# EAGLE design RS485_junction (EAGLE 9.6.2)
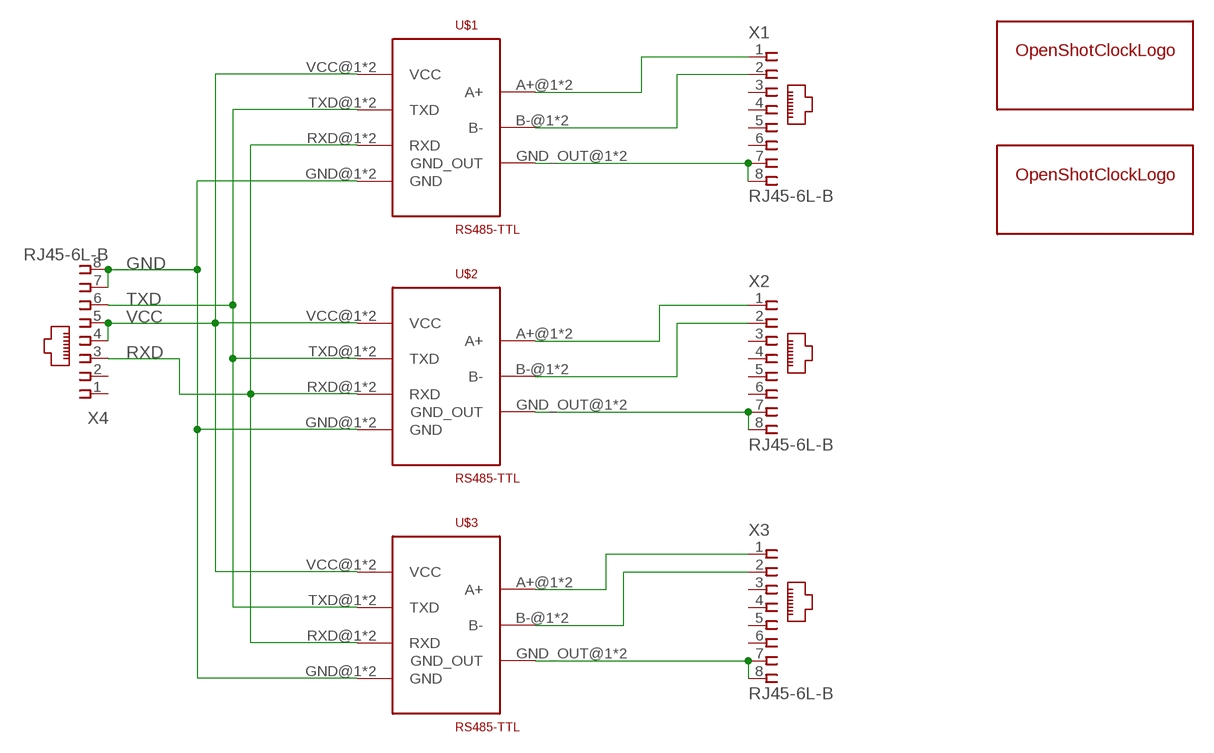
[diagram p0: schematic, sheet 1]

## Parts
U$1  RS485-TTL  [RS485-TTL]
U$2  RS485-TTL  [RS485-TTL]
U$3  RS485-TTL  [RS485-TTL]
U$4  OPEN-SHOT-CLOCK-LOGOOSCL-SMALL  [OPEN-SHOT-CLOCK-LOGO-SMALL]
U$5  OPEN-SHOT-CLOCK-LOGOOSCL-H50MM  [OPEN-SHOT-CLOCK-LOGO-H50MM]
X1  RJ45-6L-B  [RJ45-NO-SHIELD]
X2  RJ45-6L-B  [RJ45-NO-SHIELD]
X3  RJ45-6L-B  [RJ45-NO-SHIELD]
X4  RJ45-6L-B  [RJ45-NO-SHIELD]

## Nets
GND: U$1.GND@1(GND) U$1.GND@2(GND) U$2.GND@1(GND) U$2.GND@2(GND) U$3.GND@1(GND) U$3.GND@2(GND) X4.7 X4.8
N$13: U$1.A+@1(A+) U$1.A+@2(A+) X1.1
N$14: U$1.B-@1(B-) U$1.B-@2(B-) X1.2
N$15: U$1.GND_OUT@1(GND_OUT) U$1.GND_OUT@2(GND_OUT) X1.7 X1.8
N$16: U$2.A+@1(A+) U$2.A+@2(A+) X2.1
N$17: U$2.B-@1(B-) U$2.B-@2(B-) X2.2
N$18: U$2.GND_OUT@1(GND_OUT) U$2.GND_OUT@2(GND_OUT) X2.7 X2.8
N$19: U$3.GND_OUT@1(GND_OUT) U$3.GND_OUT@2(GND_OUT) X3.7 X3.8
N$20: U$3.A+@1(A+) U$3.A+@2(A+) X3.1
N$21: U$3.B-@1(B-) U$3.B-@2(B-) X3.2
RXD: U$1.RXD@1(RXD) U$1.RXD@2(RXD) U$2.RXD@1(RXD) U$2.RXD@2(RXD) U$3.RXD@1(RXD) U$3.RXD@2(RXD) X4.3
TXD: U$1.TXD@1(TXD) U$1.TXD@2(TXD) U$2.TXD@1(TXD) U$2.TXD@2(TXD) U$3.TXD@1(TXD) U$3.TXD@2(TXD) X4.6
VCC: U$1.VCC@1(VCC) U$1.VCC@2(VCC) U$2.VCC@1(VCC) U$2.VCC@2(VCC) U$3.VCC@1(VCC) U$3.VCC@2(VCC) X4.4 X4.5
Unconnected: X1.3 X1.4 X1.5 X1.6 X2.3 X2.4 X2.5 X2.6 X3.3 X3.4 X3.5 X3.6 X4.1 X4.2

## Library data of the parts
U$1-U$3 = RS485-TTL:RS485-TTL
U$4 U$5 = openShotClockLogo:OPEN-SHOT-CLOCK-LOGO
X1-X4 = RJ45_from_con-tycoel:RJ45: CORCOM Modular RJ Jacks No Shield Source: www.tycoelectronics.com .. ENG_DS_1654001_1099_RJ_L_0507.pdf; MPN: RJ45-6L-B; OC_FARNELL: unknown; OC_NEWARK: 16R6090

## Board
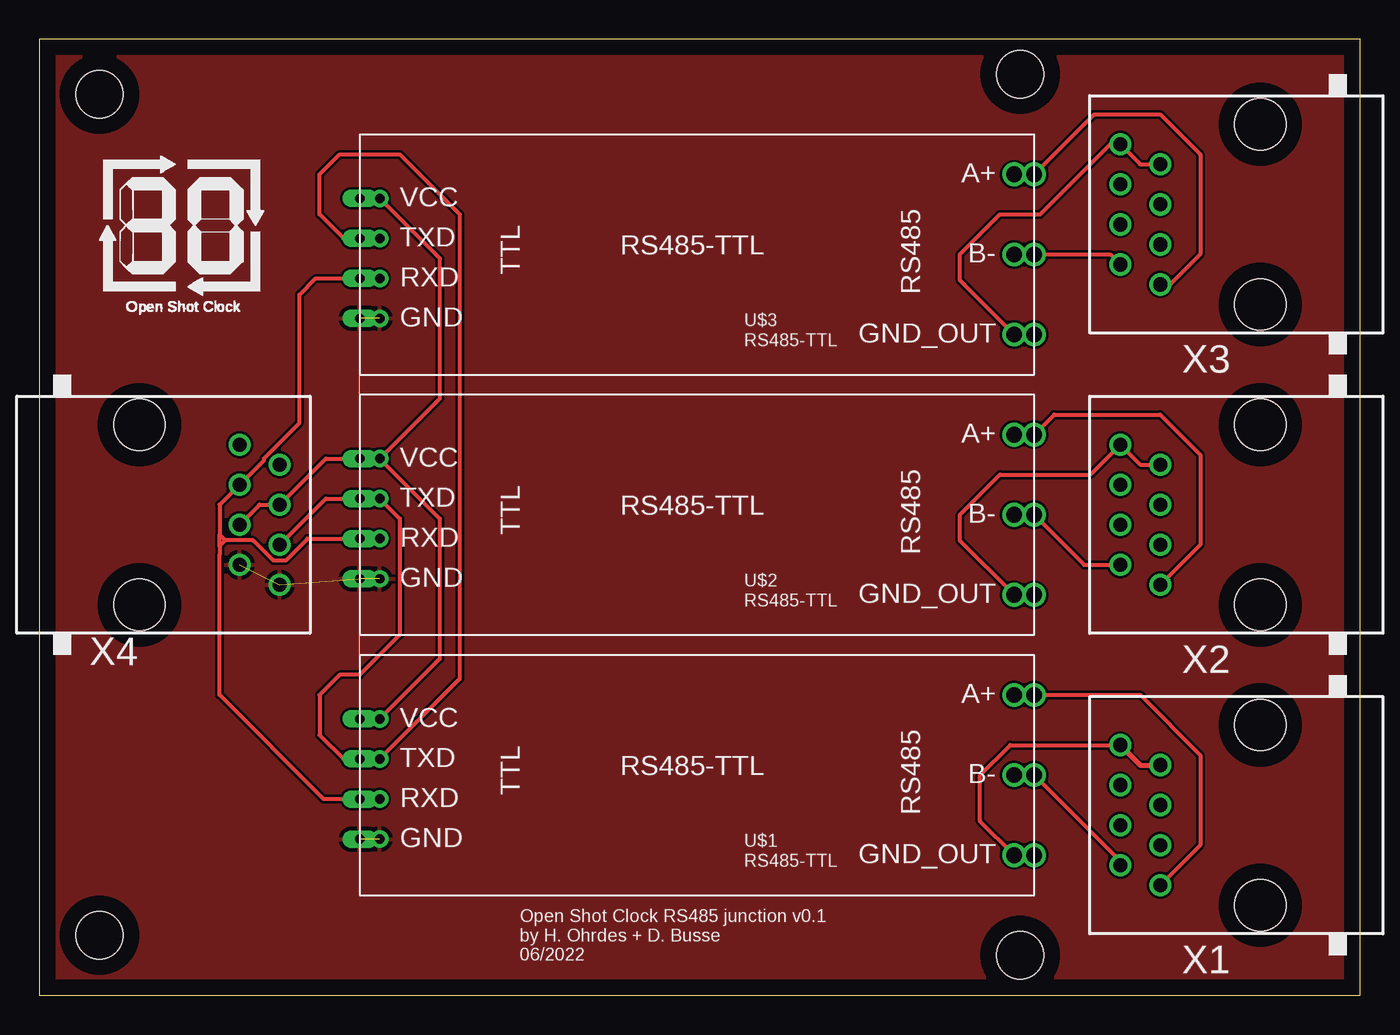
[diagram p1: board, top side]
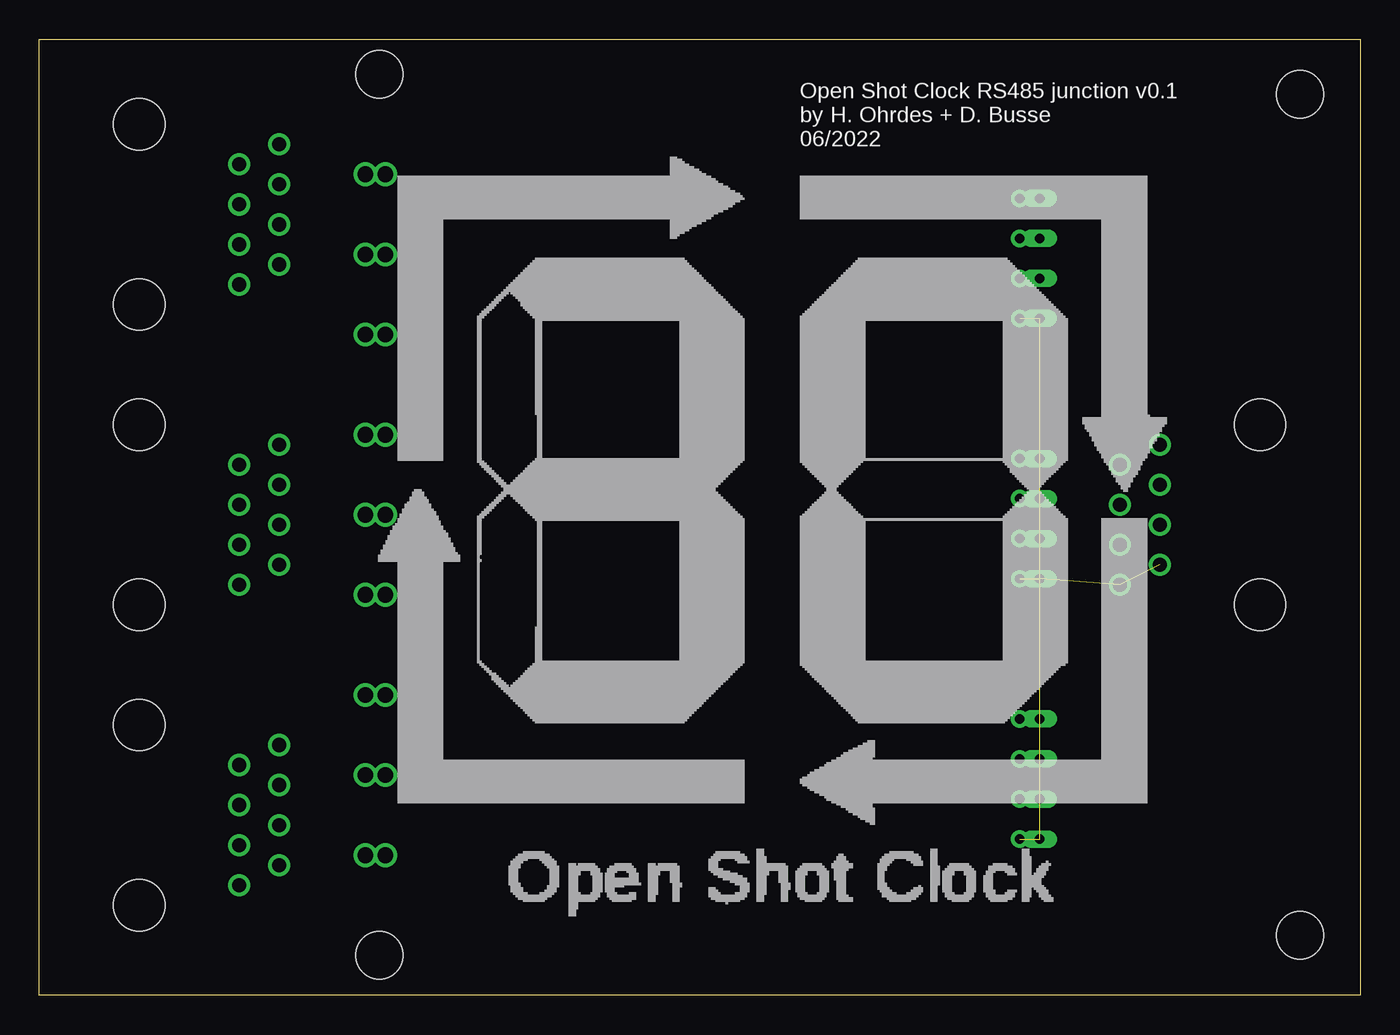
[diagram p2: board, bottom side, seen from below]

Size 83.8 x 60.63 mm. Coordinates in mm from the lower left corner, seen from the top.
Outline: 0,0 83.8,0 83.8,60.63 0,60.63 0,0
Copper layers (1*16): Top 0.035mm / dielectric 1.5mm / Bottom 0.035mm
Design rules "default": minimum track width 6mil, minimum drill 0.35mm, track to track 6mil, track to pad 6mil, pad to pad 6mil, via to via 6mil, smd to smd 6mil, copper to edge 40mil, drill to drill 6mil, minimum pad ring 10mil, minimum via ring 8mil, stop-mask expansion 4mil, vias tented up to drill 0mil, thermal gap 10mil
Holes 3 mm at 3.81,3.81 3.81,57.15 62.23,2.54 62.23,58.42

### Footprints (pad centres in the part's own frame; a part is rotated, then mirrored left to right if it is on the bottom)
RS485-TTL = drill 1: A+@1 42.8,12.7; A+@2 41.53,12.7; B-@1 42.8,7.62; B-@2 41.53,7.62; GND_OUT@1 41.53,2.54; GND_OUT@2 42.8,2.54 | drill 0.6 long: GND@1 0,3.56; RXD@1 0,6.1; TXD@1 0,8.64; VCC@1 0,11.18 | drill 0.6: GND@2 1.27,3.56; RXD@2 1.27,6.1; TXD@2 1.27,8.64; VCC@2 1.27,11.18
RJ45-NO-SHIELD = drill 0.9 pad 1.4: 1 -4.445,6.35; 2 -3.175,8.89; 3 -1.905,6.35; 4 -0.635,8.89; 5 0.635,6.35; 6 1.905,8.89; 7 3.175,6.35; 8 4.445,8.89 | hole 3.251: -5.715,0; 5.715,0

### Placement (x,y rotation side)
U$1  20.32,6.35 0 top
U$2  20.32,22.86 0 top
U$3  20.32,39.37 0 top
U$4  3.81,43.18 0 top
U$5  62.23,5.08 0 bottom
X1  77.47,11.43 90 top
X2  77.47,30.48 90 top
X3  77.47,49.53 90 top
X4  6.35,30.48 270 top

### Tracks (layer width: path | path; a pad name or v marks a point on that pad's centre or on a via)
GND  (7 unrouted)
  pour Top: 0,0 0,60.96 1.27,60.96 83.82,60.96 83.82,0
N$13
  Top 0.254: U$1.A+@2 U$1.A+@1 69.85,19.05 73.66,15.24 73.66,9.53 X1.1
N$14
  Top 0.254: U$1.B-@2 U$1.B-@1 68.58,8.51 X1.2
N$15
  Top 0.254: U$1.GND_OUT@2 U$1.GND_OUT@1 59.69,11.05 59.69,13.97 61.59,15.88 X1.8
  Top 0.305: X1.8 69.85,14.61 X1.7
N$16
  Top 0.254: U$2.A+@2 U$2.A+@1 64.39,36.83 71.12,36.83 73.66,34.29 73.66,28.57 X2.1
N$17
  Top 0.254: U$2.B-@2 U$2.B-@1 66.3,27.3 X2.2
N$18
  Top 0.254: U$2.GND_OUT@2 U$2.GND_OUT@1 58.42,28.83 58.42,30.48 60.96,33.02 66.67,33.02 X2.8 69.85,33.66 X2.7
N$19
  Top 0.254: U$3.GND_OUT@2 U$3.GND_OUT@1 58.42,45.34 58.42,46.99 60.96,49.53 63.5,49.53 67.94,53.98 X3.8 69.85,52.7 X3.7
N$20
  Top 0.254: U$3.A+@2 U$3.A+@1 66.93,55.88 71.12,55.88 73.66,53.34 73.66,46.99 71.75,45.09 X3.1
N$21
  Top 0.254: U$3.B-@2 U$3.B-@1 67.94,46.99 X3.2
RXD
  Top 0.254: U$2.RXD@2 U$2.RXD@1 17.02,28.96 15.65,27.59 14.83,27.59 13.56,28.86 11.78,28.86 | U$3.RXD@2 U$3.RXD@1 17.53,45.47 16.51,44.45 16.51,36.32 14.26,34.06 14.26,33.94 X4.3 11.43,31.11 11.43,29.21 | U$1.RXD@2 U$1.RXD@1 18.03,12.45 11.43,19.05 11.43,27.94 11.43,28.51 | 11.43,28.51 11.43,29.21 | 11.43,29.21 11.78,28.86 | 11.78,28.86 11.43,28.51
TXD
  Top 0.254: U$3.TXD@2 U$3.TXD@1 19.3,48.01 17.78,49.53 17.78,52.07 19.05,53.34 22.86,53.34 26.67,49.53 26.67,20.07 U$1.TXD@2 U$1.TXD@1 19.3,14.99 17.78,16.51 17.78,19.05 19.05,20.32 20.32,20.32 22.86,22.86 22.86,30.23 U$2.TXD@2 U$2.TXD@1 18.16,31.5 X4.6
VCC
  Top 0.254: U$2.VCC@2 U$2.VCC@1 18.16,34.04 X4.4 13.97,31.11 X4.5 | U$3.VCC@1 U$3.VCC@2 25.4,46.74 25.4,37.85 U$2.VCC@2 | U$2.VCC@2 25.4,30.23 25.4,21.34 U$1.VCC@2 U$1.VCC@1

### Text on the board
tNames: Open Shot Clock RS485 junction v0.1 / by H. Ohrdes + D. Busse / 06/2022
bNames: Open Shot Clock RS485 junction v0.1 / by H. Ohrdes + D. Busse / 06/2022